# EAGLE design BSPD 5 (Hank) (EAGLE 8.4.0)
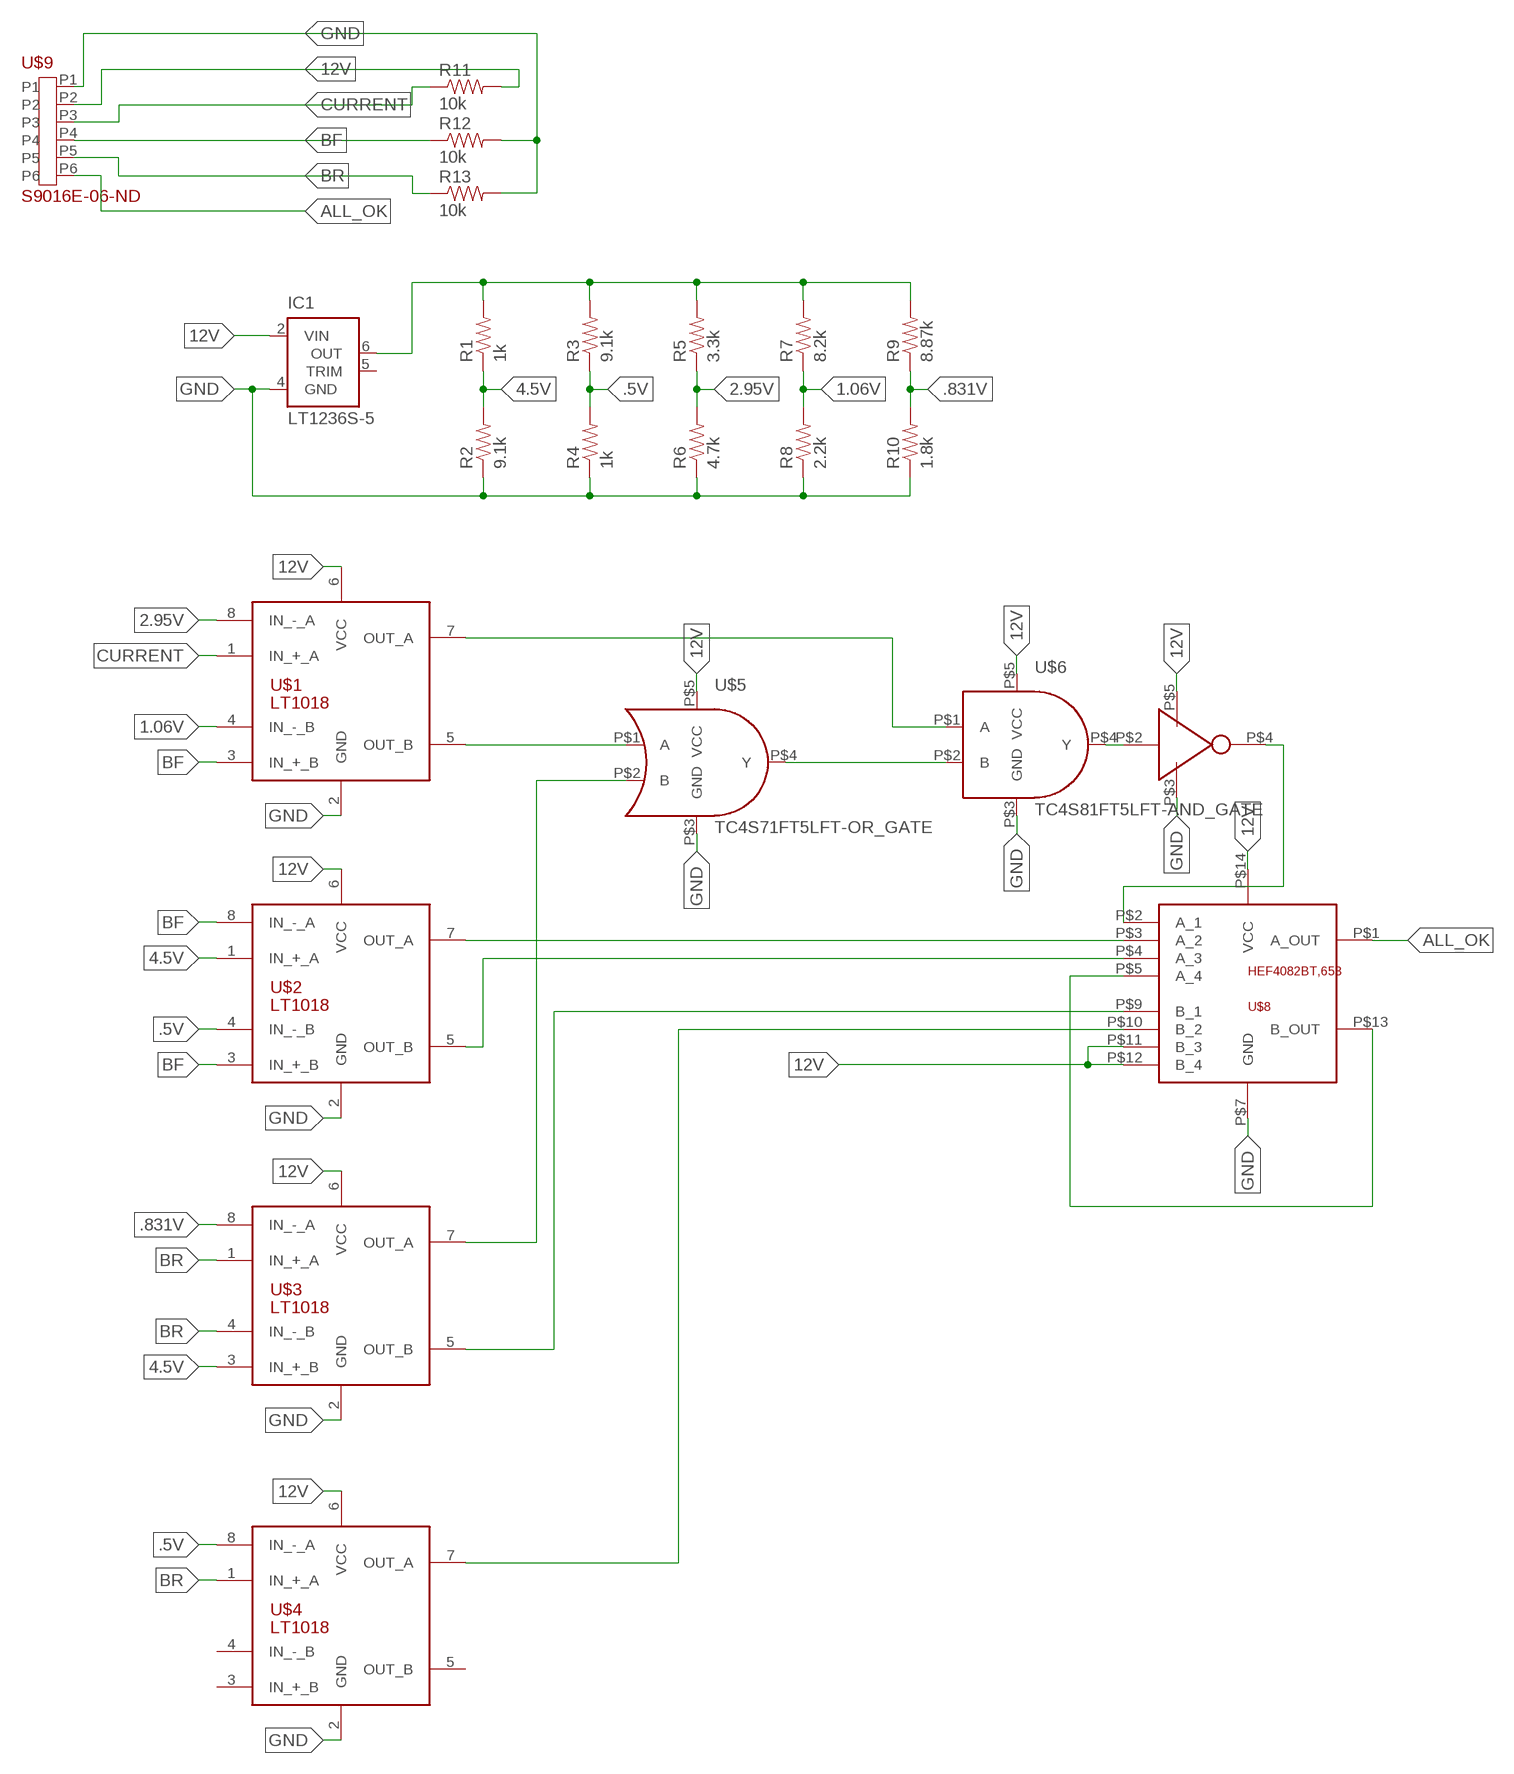
[diagram p0: schematic, sheet 1]

## Parts
IC1  LT1236S-5  [SOIC8]
R1  1k  RESISTOR0603  [0603-RES]
R2  9.1k  RESISTOR0603  [0603-RES]
R3  9.1k  RESISTOR0603  [0603-RES]
R4  1k  RESISTOR0603  [0603-RES]
R5  3.3k  RESISTOR0603  [0603-RES]
R6  4.7k  RESISTOR0603  [0603-RES]
R7  8.2k  RESISTOR0603  [0603-RES]
R8  2.2k  RESISTOR0603  [0603-RES]
R9  8.87k  RESISTOR0603  [0603-RES]
R10  1.8k  RESISTOR0603  [0603-RES]
R11  10k  RESISTOR0603  [0603-RES]
R12  10k  RESISTOR0603  [0603-RES]
R13  10k  RESISTOR0603  [0603-RES]
U$1  LT1018  [SOIC8]
U$2  LT1018  [SOIC8]
U$3  LT1018  [SOIC8]
U$4  LT1018  [SOIC8]
U$5  TC4S71FT5LFT-OR_GATE  [SSOP5-P-0.95]
U$6  TC4S81FT5LFT-AND_GATE  [SSOP5-P-0.95]
U$7  TC4S69F(TE85L,F)  [SSOP5-P-0.95]
U$8  HEF4082BT,653  [NXP_14_SOIC]
U$9  S9016E-06-ND  [S9016E-05-ND]

## Nets
1.06V: R7.1 R8.2 U$1.4(IN_-_B)
2.95V: R5.1 R6.2 U$1.8(IN_-_A)
4.5V: R1.1 R2.2 U$2.1(IN_+_A) U$3.3(IN_+_B)
12V: IC1.2(VIN) R11.2 U$1.6(VCC) U$2.6(VCC) U$3.6(VCC) U$4.6(VCC) U$5.P$5(VCC) U$6.P$5(VCC) U$7.P$5(VCC) U$8.P$11(B_3) U$8.P$12(B_4) U$8.P$14(VCC) U$9.P2
.5V: R3.1 R4.2 U$2.4(IN_-_B) U$4.8(IN_-_A)
.831V: R9.1 R10.2 U$3.8(IN_-_A)
ALL_OK: U$8.P$1(A_OUT) U$9.P6
BF: R12.1 U$1.3(IN_+_B) U$2.3(IN_+_B) U$2.8(IN_-_A) U$9.P4
BR: R13.1 U$3.1(IN_+_A) U$3.4(IN_-_B) U$4.1(IN_+_A) U$9.P5
CURRENT: R11.1 U$1.1(IN_+_A) U$9.P3
GND: IC1.4(GND) R2.1 R4.1 R6.1 R8.1 R10.1 R12.2 R13.2 U$1.2(GND) U$2.2(GND) U$3.2(GND) U$4.2(GND) U$5.P$3(GND) U$6.P$3(GND) U$7.P$3(GND) U$8.P$7(GND) U$9.P1
N$1: IC1.6(OUT) R1.2 R3.2 R5.2 R7.2 R9.2
N$2: U$1.5(OUT_B) U$5.P$1(A)
N$3: U$3.7(OUT_A) U$5.P$2(B)
N$4: U$5.P$4(Y) U$6.P$2(B)
N$5: U$1.7(OUT_A) U$6.P$1(A)
N$6: U$6.P$4(Y) U$7.P$2(IN)
N$7: U$7.P$4(OUT) U$8.P$2(A_1)
N$8: U$2.7(OUT_A) U$8.P$3(A_2)
N$9: U$2.5(OUT_B) U$8.P$4(A_3)
N$10: U$8.P$5(A_4) U$8.P$13(B_OUT)
N$11: U$3.5(OUT_B) U$8.P$9(B_1)
N$12: U$4.7(OUT_A) U$8.P$10(B_2)
Unconnected: IC1.5(TRIM) U$4.3(IN_+_B) U$4.4(IN_-_B) U$4.5(OUT_B)

## Library data of the parts
IC1 = linear-technology:LT1236?*: Precision Voltage Reference Source: http://www.linear.com/pc/downloadDocument.do?navId=H0,C1,C1154,C1002,C1243,P1156,D2948; OC_FARNELL: unknown; OC_NEWARK: unknown
R1-R13 = SparkFun-Resistors:RESISTOR: Resistor Basic schematic elements and footprints for 0603, 1206, and PTH resistors.
U$1-U$4 = linear-technology:LT1018
U$5 = formula electric:TC4S71FT5LFT-OR_GATE
U$6 = formula electric:TC4S81FT5LFT-AND_GATE: TC4S81FT5LFTCT-ND
U$7 = formula electric:TC4S69F(TE85L,F)
U$8 = formula electric:HEF4082BT,653: 568-7702-1-ND
U$9 = S9016E-06-ND:S9016E-06-ND

## Board
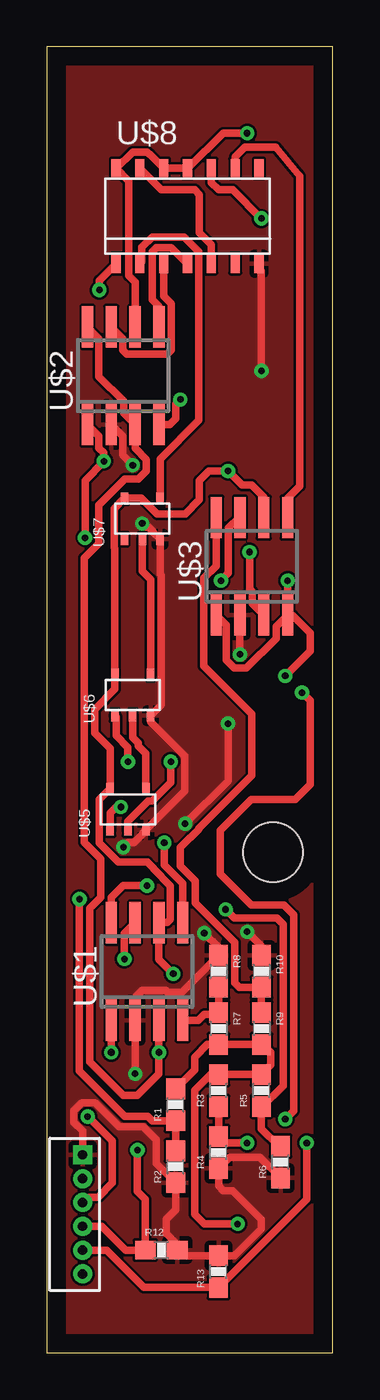
[diagram p1: board, top side]
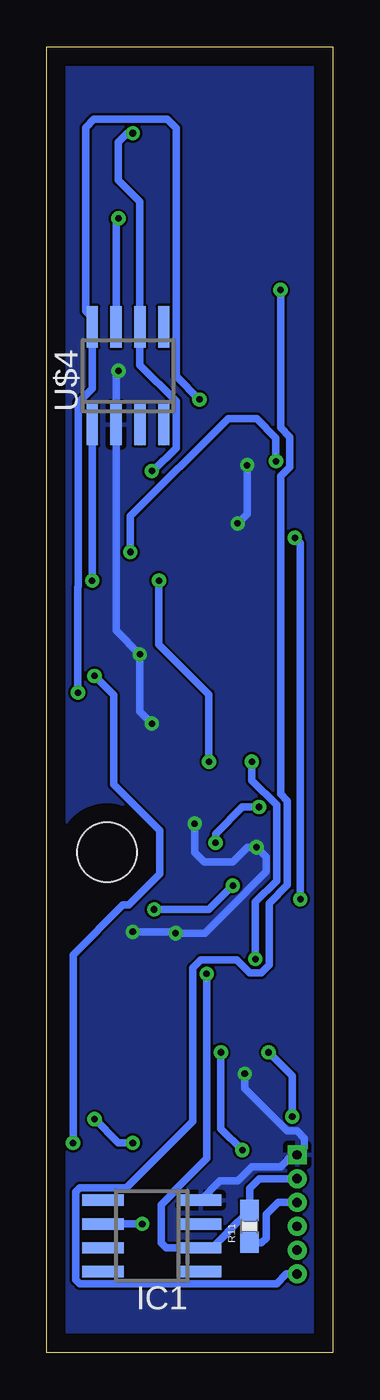
[diagram p2: board, bottom side, seen from below]

Size 15.24 x 69.6 mm. Coordinates in mm from the lower left corner, seen from the top.
Outline: 0,0 15.24,0 15.24,69.6 0,69.6 0,0
Copper layers (1*16): Top 0.035mm / dielectric 1.5mm / Bottom 0.035mm
Design rules "default *": minimum track width 6mil, minimum drill 0.35mm, track to track 5mil, track to pad 5mil, pad to pad 5mil, via to via 5mil, smd to smd 5mil, copper to edge 40mil, drill to drill 6mil, minimum pad ring 10mil, minimum via ring 8mil, stop-mask expansion 4mil, vias tented up to drill 0mil, thermal gap 10mil
Holes 3.18 mm at 12.04,26.67

### Footprints (pad centres in the part's own frame; a part is rotated, then mirrored left to right if it is on the bottom)
SOIC8 = smd 0.6 x 2.2: 1 -1.905,-2.6; 2 -0.635,-2.6; 3 0.635,-2.6; 4 1.905,-2.6; 5 1.905,2.6; 6 0.635,2.6; 7 -0.635,2.6; 8 -1.905,2.6
0603-RES = smd 1.1 x 1: 1 -0.85,0; 2 0.85,0
SSOP5-P-0.95 = smd 0.6 x 0.4: P$1 -1.1,0.95; P$2 -1.1,0; P$3 -1.1,-0.95; P$4 1.1,-0.95; P$5 1.1,0.95
NXP_14_SOIC = smd 0.49 x 1: P$1 -3.81,-2.54; P$2 -2.54,-2.54; P$3 -1.27,-2.54; P$4 0,-2.54; P$5 1.27,-2.54; P$6 2.54,-2.54; P$7 3.81,-2.54; P$8 3.81,2.54; P$9 2.54,2.54; P$10 1.27,2.54; P$11 0,2.54; P$12 -1.27,2.54; P$13 -2.54,2.54; P$14 -3.81,2.54
S9016E-05-ND = drill 0.5 pad 0.61 square: P1 0,0 | drill 0.5 pad 0.61: P2 1.27,0; P3 2.54,0; P4 3.81,0; P5 5.08,0; P6 6.35,0

### Placement (x,y rotation side)
IC1  9.65,6.22 90 bottom
R1  6.86,13.21 90 top
R2  6.86,9.91 90 top
R3  9.14,13.97 90 top
R4  9.14,10.67 90 top
R5  11.43,13.97 90 top
R6  12.45,10.16 90 top
R7  9.14,17.27 270 top
R8  9.14,20.32 270 top
R9  11.43,17.27 270 top
R10  11.43,20.32 270 top
R11  4.45,6.73 90 bottom
R12  6.1,5.46 0 top
R13  9.14,4.32 90 top
U$1  5.33,20.32 0 top
U$2  4.06,52.07 0 top
U$3  10.92,41.91 0 top
U$4  10.92,52.07 0 bottom
U$5  4.32,28.96 90 top
U$6  4.57,35.05 90 top
U$7  5.08,44.45 90 top
U$8  7.49,60.58 0 top
U$9  1.91,10.54 270 top

### Tracks (layer width: path | path; a pad name or v marks a point on that pad's centre or on a via)
1.06V
  Top 0.406: R8.2 R7.1 9.06,18.03 8.38,18.03 8.07,17.72 U$1.4
2.95V  (via drill 0.35)
  Top 0.406: v9.53,23.62 9.98,23.16 12.26,23.16 12.59,22.83 12.59,14.22 11.49,13.12 R5.1 11.43,11.94 12.36,11.01 R6.2 | U$1.8 3.43,24.26 4.06,24.89 v5.33,24.89
  Bottom 0.406: v5.33,24.89 6.6,23.62 v9.53,23.62
4.5V  (via drill 0.35)
  Top 0.406: R2.2 R1.1 5.6,12.36 5.36,12.6 5.09,12.6 5.08,12.6 4.14,12.6 1.73,15.02 1.73,24.16 v1.74,24.17 | U$2.1 2.77,48.86 2.77,48.22 3.04,47.96 v3.04,47.51 3.04,47.48 2.03,46.48 v2.03,43.43 | U$3.3 10.94,39.92 10.94,40.56 10.79,40.7 v10.79,42.67
  Bottom 0.406: v1.74,24.17 1.74,43.14 v2.03,43.43 | v3.04,47.51 3.04,48.76 4.06,49.78 5.59,49.78 10.79,44.58 v10.79,42.67
12V  (via drill 0.35)
  Top 0.406: U$2.6 4.7,57.05 4.35,57.39 4.35,62.45 U$8.P$14 3.71,63.12 4.56,63.98 5.34,63.98 5.45,63.87 5.47,63.87 U$8.P$12 U$8.P$11 7.51,63.12 9.39,65 v10.67,65 | v6.73,20.19 5.97,20.95 U$1.6 6.41,22.92 6.58,23.09 6.58,24.88 5.69,25.77 5.69,25.8 5.33,26.16 3.81,26.16 2.79,27.18 2.79,29.48 U$5.P$5 3.37,32.19 2.54,33.02 2.54,34.29 3.62,35.37 U$6.P$5 3.62,42.85 3.57,42.9 3.57,44.99 U$7.P$5 5.03,45.55 5.87,44.7 7.37,44.7 8.13,45.47 8.13,46.48 8.64,46.99 v9.65,46.99 10.41,46.23 10.92,46.23 11.56,45.59 U$3.6
  Bottom 0.406: U$9.P2 3.94,9.27 4.45,8.76 R11.2 5.6,6.43 5.6,6.41 6.42,5.59 IC1.2 8.89,5.59 9.14,5.84 9.14,7.87 8.51,8.51 8.51,8.57 6.73,10.35 v6.73,20.19 | v10.67,65 10.95,65 11.43,64.52 11.43,62.48 10.29,61.34 U$4.6 10.29,52.64 8.36,50.72 8.36,48.22 9.59,46.99 v9.65,46.99
.5V  (via drill 0.35)
  Top 0.406: R3.1 R4.2 9.49,11.18 v10.67,11.18 | v7.11,50.8 6.86,50.55 6.86,49.78 6.54,49.47 U$2.4 | v13.59,35.18 14.02,34.75 14.02,30.28 13.22,29.48 10.88,29.48 9.23,27.83 9.23,25.51 10.88,23.86 12.61,23.86 13.15,23.32 13.15,12.89 v12.7,12.45
  Bottom 0.406: v7.11,50.8 8.36,52.05 8.36,65.25 8.84,65.73 12.75,65.73 13.18,65.3 13.18,55.5 12.83,55.15 U$4.8 12.83,51.37 13.56,50.64 13.56,40.84 13.59,40.82 v13.59,35.18 13.72,35.31 | v12.7,12.45 11.43,11.18 v10.67,11.18
.831V
  Top 0.406: R9.1 R10.2 10.25,19.47 10,19.72 10,21.87 7.89,23.97 7.89,25.15 7.11,25.94 7.11,26.92 7.65,27.46 7.67,27.46 8.1,27.89 8.1,27.93 10.92,30.75 10.92,34.04 8.36,36.6 8.36,41.28 9.02,41.93 U$3.8
ALL_OK  (via drill 0.35)
  Top 0.406: v2.79,56.64 2.79,57.15 U$8.P$1
  Bottom 0.406: U$9.P6 2.48,4.19 3,3.66 13.5,3.66 13.71,3.87 13.71,8.57 13.5,8.78 11.01,8.78 7.46,12.32 7.46,20.5 7.04,20.93 5.12,20.93 4.44,20.25 3.83,20.25 3.4,20.68 3.4,23.95 2.44,24.91 2.44,29.41 2.79,29.77 2.79,46.71 2.3,47.21 2.3,48.81 2.79,49.3 v2.79,56.64
BF  (via drill 0.35)
  Top 0.406: v4.83,10.79 4.83,8.6 5.25,8.18 R12.1 4.19,5.46 2.92,6.73 U$9.P4 | U$2.8 2.77,54.06 2.77,52.03 4.08,50.72 4.08,50.08 U$2.3 4.7,48.21 5.31,47.6 5.31,47 4.88,46.57 4.14,46.57 3.57,46 3.57,45.99 2.77,45.18 2.77,43.13 1.98,42.34 1.98,27.2 2.87,26.31 2.87,24.26 2.29,23.68 2.29,15.49 4.06,13.72 4.83,13.72 5.97,14.86 v5.97,16 U$1.3
  Bottom 0.406: v4.83,10.79 5.97,11.94 v5.97,16
BR  (via drill 0.35)
  Top 0.406: v12.83,41.15 U$3.4 12.79,39.28 | U$9.P5 3.17,5.46 5.17,3.47 R13.1 13.85,8.17 v13.85,11.18 | 12.79,39.28 12.21,38.7 12.21,38.06 10.63,36.48 9.98,36.48 9.55,36.91 9.55,38.77 U$3.1 | v12.7,36.07 14.02,37.39 14.02,38.35 13.1,39.28 12.79,39.28
  Bottom 0.406: v12.83,41.15 U$4.1 | v13.85,11.18 13.85,21.21 11.19,23.86 10.88,23.86 9.23,25.51 9.23,27.83 11.68,30.29 11.68,35.05 v12.7,36.07
CURRENT  (via drill 0.35)
  Top 0.406: U$9.P3 2.19,8.29 2.73,8.29 3.48,9.04 3.48,11.27 v2.17,12.58 | v3.43,16 U$1.1
  Bottom 0.406: U$9.P3 2.92,8 3.56,7.37 3.56,6.1 3.81,5.84 4.41,5.84 R11.1 | v2.17,12.58 2.17,14.74 v3.43,16
GND  (via drill 0.35)
  Top 0.406: 7.24,5.46 R12.2 | U$9.P1 1.91,11.81 1.44,12.28 1.44,12.89 1.87,13.32 2.58,13.32 3.86,12.04 5.13,12.04 5.81,11.35 5.81,10.1 R2.1 | 6.77,9.14 R2.1 | R2.1 6.95,8.97 | v11.43,52.32 11.43,57.63 11.35,57.72 11.35,58 U$8.P$7 | U$2.2 4.04,48.86 4.04,47.83 v4.57,47.3 | v5.08,44.2 5.27,44.01 5.43,44.01 5.64,43.8 5.64,43.74 U$7.P$3 6.03,41.5 6.08,41.45 6.08,34.51 U$6.P$3 5.52,33.62 7.34,31.8 7.34,29.93 U$5.P$3 5.11,27.7 5.11,27.64 4.67,27.2 4.34,27.2 v4.08,26.93 | 6.82,9.02 R2.1 | v4.7,14.86 U$1.2 4.7,18.92 5.08,19.3 6.33,19.3 6.43,19.2 7.18,19.2 R8.1 9.14,21.59 v8.38,22.35 | R2.1 6.86,7.62 6.35,7.11 6.35,6.35 6.95,5.75 R12.2 | R12.2 7.24,5.17 R13.2 9.99,5.17 11.43,6.6 11.43,7.11 9.91,8.64 9.4,8.64 9.14,8.89 R4.1 9.74,10.41 11.34,10.41 R6.1 | v10.67,22.43 11.43,21.67 R10.1 | v7.37,28.19 9.65,30.48 v9.65,33.53 | v10.29,37.21 U$3.2
  Bottom 0.406: v11.43,52.32 11.56,52.2 U$4.2 11.56,38.48 v10.29,37.21 10.29,34.16 v9.65,33.53 | IC1.4 6.04,9.14 5.08,9.14 4.32,9.91 2.79,9.91 2.16,10.54 U$9.P1 1.52,10.92 1.52,11.43 1.91,11.81 2.44,11.81 4.7,14.07 v4.7,14.86 | v10.67,22.43 8.46,22.43 v8.38,22.35 6.84,22.35 4.6,24.59 4.6,24.61 3.56,25.65 3.56,26.42 v4.08,26.93 4.56,26.93 5.33,26.16 6.86,26.16 7.37,26.67 v7.37,28.19 | v4.57,47.3 4.57,44.7 v5.08,44.2
  pour Bottom: -0.25,103.12 15.49,103.12 15.49,-0.25 -0.25,-0.25
  pour Top: -0.25,103.12 15.49,103.12 15.49,91.44 15.49,-0.25 8.38,-0.25 -0.25,-0.25 -0.25,13.46
N$1  (via drill 0.35)
  Top 0.406: R7.2 R9.2 11.52,16.42 11.94,16 11.94,15.33 R5.2 R3.2 8.72,14.82 7.87,13.97 7.87,7.37 8.38,6.86 v10.16,6.86 | 7.02,14.06 R1.2 7.87,15.07 7.87,15.75 8.55,16.42 R7.2 | 8.98,16.26 R7.2
  Bottom 0.406: IC1.6 v10.16,6.86
N$2  (via drill 0.35)
  Top 0.406: 3.37,28.01 U$5.P$1 3.37,28.77 3.68,29.08 v3.94,29.08 | v6.25,27.18 6.25,26 7.24,25.02 U$1.5
  Bottom 0.406: v6.25,27.18 6.25,27.66 4.83,29.08 v3.94,29.08
N$3  (via drill 0.35)
  Top 0.406: U$5.P$2 4.32,28.32 5.4,29.4 5.62,29.4 6.6,30.39 v6.6,31.5 | v9.27,41.15 9.67,41.55 9.67,43.94 10.24,44.51 U$3.7
  Bottom 0.406: v9.27,41.15 9.27,37.74 6.6,35.07 v6.6,31.5
N$4
  Top 0.406: U$5.P$4 5.27,31.94 4.88,32.33 4.88,32.49 4.57,32.79 U$6.P$2
N$5  (via drill 0.35)
  Top 0.406: U$1.7 4.13,22.35 v4.13,20.98 | v4.32,31.5 4.32,32.26 3.68,32.89 3.68,33.89 U$6.P$1
  Bottom 0.406: 4.13,20.9 v4.13,20.98 4.13,24.01 3,25.15 3,29.18 4.32,30.5 v4.32,31.5
N$6
  Top 0.406: U$6.P$4 5.52,41.21 5.08,41.66 U$7.P$2
N$7
  Top 0.406: U$8.P$2 5.06,58.15 5.06,58.92 5.6,59.45 7.33,59.45 8.09,58.69 8.09,49.69 6.03,47.63 U$7.P$4
N$8
  Top 0.406: U$2.7 4.04,54.06 4.04,53.42 4.25,53.21 6.42,53.21 6.62,53.42 6.62,55.92 6.22,56.32 U$8.P$3
N$9
  Top 0.406: U$2.5 5.97,55.78 5.62,56.13 5.62,58.69 5.83,58.9 6.62,58.9 7.47,58.04 U$8.P$4
N$10
  Top 0.406: U$8.P$13 6.1,61.98 7.87,61.98 8.13,61.72 8.13,59.69 8.76,59.05 U$8.P$5
N$11
  Top 0.406: U$3.5 12.83,45.53 13.48,46.19 13.48,62.72 12.19,64.26 10.54,64.26 10.03,63.75 U$8.P$9
N$12  (via drill 0.35)
  Top 0.406: v11.43,60.45 9.91,61.98 9.14,61.98 8.76,62.36 U$8.P$10
  Bottom 0.406: U$4.7 11.56,60.33 v11.43,60.45